# Altium schematic sheet W5500_Ethernet.SchDoc: =SheetTitle
size B; SheetTitle: W5500 Ethernet Controller; DrawnBy: Samyar Sadat Akhavi
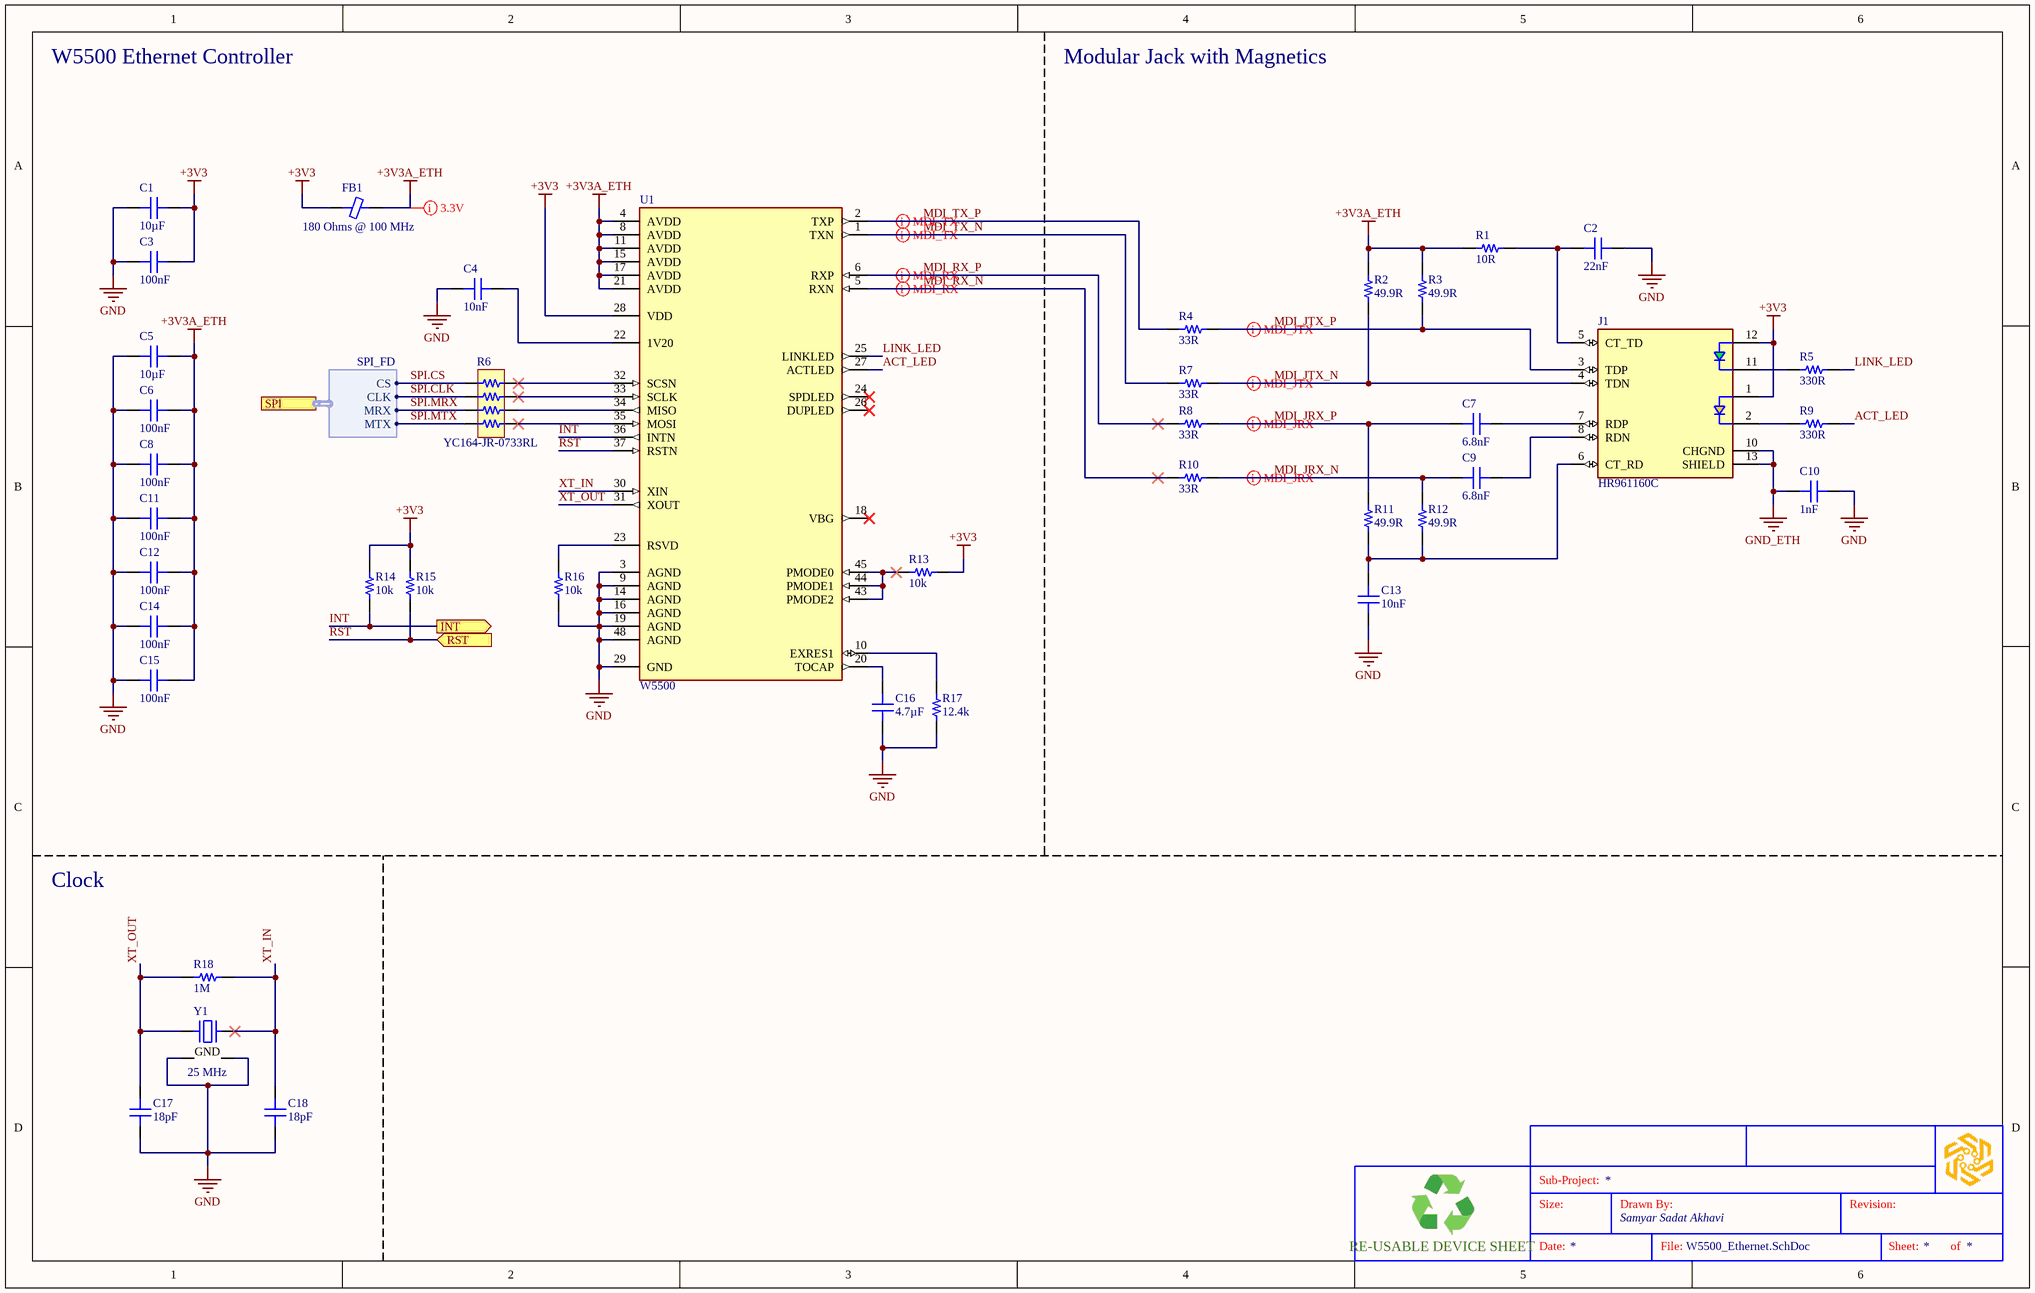
[diagram p0: W5500_Ethernet.SchDoc]

## Parts
?  (no value)  (graphical)
C1  10µF  [CAP 1206_3216]
C2  22nF  [CAP 0603_1608]
C3  100nF  [CAP 0603_1608]
C4  10nF  [CAP 0603_1608]
C5  10µF  [CAP 1206_3216]
C6  100nF  [CAP 0603_1608]
C7  6.8nF  [CAP 0603_1608]
C8  100nF  [CAP 0603_1608]
C9  6.8nF  [CAP 0603_1608]
C10  1nF  [CAP 1206_3216]
C11  100nF  [CAP 0603_1608]
C12  100nF  [CAP 0603_1608]
C13  10nF  [CAP 0603_1608]
C14  100nF  [CAP 0603_1608]
C15  100nF  [CAP 0603_1608]
C16  4.7µF  [CAP 0603_1608]
C17  18pF  [CAP 0603_1608]
C18  18pF  [CAP 0603_1608]
FB1  180 Ohms @ 100 MHz  [FER 0603_1608]
GRAPH?  SGR-STDDSM  (value not drawn)  (graphical)
J1  HR961160C  [HANRUN_HR961160C]
R1  10R  [RES 0603_1608]
R2  49.9R  [RES 0603_1608]
R3  49.9R  [RES 0603_1608]
R4  33R  [RES 0603_1608]
R5  330R  [RES 0603_1608]
R6  YC164-JR-0733RL  [RESNET 1206-8 CONVEX]
R7  33R  [RES 0603_1608]
R8  33R  [RES 0603_1608]
R9  330R  [RES 0603_1608]
R10  33R  [RES 0603_1608]
R11  49.9R  [RES 0603_1608]
R12  49.9R  [RES 0603_1608]
R13  10k  [RES 0603_1608]
R14  10k  [RES 0603_1608]
R15  10k  [RES 0603_1608]
R16  10k  [RES 0603_1608]
R17  12.4k  [RES 0603_1608]
R18  1M  [RES 0603_1608]
U1  W5500  [48LQFP_W5500_WIZ]
Y1  25 MHz  [EPSON TSX-3225]

## Ports
INT (out, see Power_Board[3B]), RST (in, see Power_Board[3B]), SPI (harness SPI_FD, see Power_Board[3B])

## Harnesses
SPI_FD: CLK, CS, MRX, MTX

## Nets
+3V3: C1.2 C3.1 FB1.1 J1.1(YLW_A) J1.12(GRN_A) R13.1 R14.2 R15.1 U1.28(VDD)
+3V3A_ETH: C5.2 C6.1 C8.1 C11.1 C12.1 C14.1 C15.1 FB1.2 R1.2 R2.2 R3.2 U1.4(AVDD) U1.8(AVDD) U1.11(AVDD) U1.15(AVDD) U1.17(AVDD) U1.21(AVDD)
GND: C1.1 C2.2 C3.2 C4.2 C5.1 C6.2 C8.2 C10.1 C11.2 C12.2 C13.2 C14.2 C15.2 C16.1 C17.1 C18.1 R16.2 R17.1 U1.3(AGND) U1.9(AGND) U1.14(AGND) U1.16(AGND) U1.19(AGND) U1.29(GND) U1.48(AGND) Y1.2(GND) Y1.4(GND)
GND_ETH: C10.2 J1.10(CHGND) J1.13(SHIELD)
ACT_LED: R9.2 U1.27(ACTLED)
INT: R14.1 U1.36(INTN) ; port INT
LINK_LED: R5.2 U1.25(LINKLED)
MDI_JRX_N: C9.1 R10.2 R12.2
MDI_JRX_P: C7.2 R8.2 R11.2
MDI_JTX_N: J1.4(TDN) R2.1 R7.2
MDI_JTX_P: J1.3(TDP) R3.1 R4.2
MDI_RX_N: R10.1 U1.5(RXN)
MDI_RX_P: R8.1 U1.6(RXP)
MDI_TX_N: R7.1 U1.1(TXN)
MDI_TX_P: R4.1 U1.2(TXP)
RST: R15.2 U1.37(RSTN) ; port RST
SPI.CLK: R6.2 ; port SPI.CLK
SPI.CS: R6.1 ; port SPI.CS
SPI.MRX: R6.3 ; port SPI.MRX
SPI.MTX: R6.4 ; port SPI.MTX
XT_IN: C18.2 R18.2 U1.30(XIN) Y1.3
XT_OUT: C17.2 R18.1 U1.31(XOUT) Y1.1
NetC2_1: C2.1 J1.5(CT_TD) R1.1
NetC4_1: C4.1 U1.22(1V20)
NetC7_1: C7.1 J1.7(RDP)
NetC9_2: C9.2 J1.8(RDN)
NetC13_1: C13.1 J1.6(CT_RD) R11.1 R12.1
NetC16_2: C16.2 U1.20(TOCAP)
NetJ1_2: J1.2(YLW_K) R9.1
NetJ1_11: J1.11(GRN_K) R5.1
NetR6_5: R6.5 U1.35(MOSI)
NetR6_6: R6.6 U1.34(MISO)
NetR6_7: R6.7 U1.33(SCLK)
NetR6_8: R6.8 U1.32(SCSN)
NetR13_2: R13.2 U1.43(PMODE2) U1.44(PMODE1) U1.45(PMODE0)
NetR16_1: R16.1 U1.23(RSVD)
NetR17_2: R17.2 U1.10(EXRES1)

Not connected (* = marked no-connect by the designer): U1 18(VBG)* 24(SPDLED)* 26(DUPLED)*

## Layout directives
differential pair: MDI_JRX_N, MDI_JRX_P, MDI_JTX_N, MDI_JTX_P, MDI_RX_N, MDI_RX_P, MDI_TX_N, MDI_TX_P
rule Supply Nets [Voltage = 3.300]: +3V3A_ETH

## Notes on the sheet
- W5500 Ethernet Controller
- Modular Jack with Magnetics
- Clock
- Sub-Project:
- Size:
- Drawn By:
- Revision:
- Date:
- File:
- Sheet:
- of
- (in symbol SGR-STDDSM) RE-USABLE DEVICE SHEET

## Library data of the parts
? = SGR-STDTBSB: STANDARD SCHEMATICS TITLE BLOCK
C1 C5 = GEN-CC10UT10V25KX7R1206: GENERIC 1206 MLC CAPACITOR; Tolerance: ±10%; Voltage: 25V; Dielectric: X7R; Part Number: GEN-CC10UT10V25KX7R1206; Value: 10µF
C2 = GEN-CC22NT20V25KX7R603: GENERIC 0603 MLC CAPACITOR; Tolerance: ±20%; Voltage: 25V; Dielectric: X7R; Part Number: GEN-CC22NT20V25KX7R603; Value: 22nF
C3 C6 C8 C11 C12 C14 C15 = GEN-CC100NT10V50KX7R603: GENERIC 0603 MLC CAPACITOR; Tolerance: ±10%; Voltage: 50V; Dielectric: X7R; Part Number: GEN-CC100NT10V50KX7R603; Value: 100nF
C4 C13 = GEN-CC10NT10V50KX7R603: GENERIC 0603 MLC CAPACITOR; Tolerance: ±10%; Voltage: 50V; Dielectric: X7R; Part Number: GEN-CC10NT10V50KX7R603; Value: 10nF
C7 C9 = GEN-CC6N8T10V50KX7R603: GENERIC 0603 MLC CAPACITOR; Tolerance: ±10%; Voltage: 50V; Dielectric: X7R; Part Number: GEN-CC6N8T10V50KX7R603; Value: 6.8nF
C10 = GEN-CC1NT10V2000KX7R1206: GENERIC 1206 MLC CAPACITOR; Tolerance: ±10%; Voltage: 2000V; Dielectric: X7R; Part Number: GEN-CC1NT10V2000KX7R1206; Value: 1nF
C16 = GEN-CC4U7T106V3KX7R603: GENERIC 0603 MLC CAPACITOR; Tolerance: ±10%; Voltage: 6.3V; Dielectric: X7R; Part Number: GEN-CC4U7T106V3KX7R603; Value: 4.7µF
C17 C18 = GEN-CC18PT5V50KC0G603: GENERIC 0603 MLC CAPACITOR; Tolerance: ±5%; Voltage: 50V; Dielectric: C0G; Part Number: GEN-CC18PT5V50KC0G603; Value: 18pF
FB1 = MPZ1608S181ATAH0: FERRITE BEAD 180 OHM 0603 1LN; Manufacturer: TDK Corporation; Current Rating (Max): 2A; DC Resistance (DCR) (Max): 50mOhm; Filter Type: Power Line; Number of Lines: 1; Part Number: MPZ1608S181ATAH0; ComponentLink1Description: Datasheet; ComponentLink1URL: https://product.tdk.com/info/en/catalog/datasheets/beads_commercial_power_mpz1608_en.pdf?ref_disty=digikey; ComponentLink2Description: DigiKey Link; ComponentLink2URL: https://www.digikey.com/en/products/detail/tdk-corporation/MPZ1608S181ATAH0/2117944; Device Package: 0603 (1608 Metric); Height (Max): 0.030" (0.75mm); Impedance @ Frequency: 180 Ohms @ 100 MHz; LastUpdated: 4/5/2026 8:28:05 PM; Lifecycle Status: Active; Minimum Order: 1; Mounting Type: Surface Mount; Operating Temperature: -55°C ~ 125°C; Package / Case: 0603 (1608 Metric); Packaging: TapeAndReel; PartId: 1025; Part Status: Active; Price: 0.02; Series: MPZ; Size / Dimension: 0.063" L x 0.031" W (1.60mm x 0.80mm); Supplier 1: DigiKey; Supplier Part Number 1: 445-MPZ1608S181ATAH0CT-ND; Value: 180 Ohms @ 100 MHz
GRAPH? = SGR-STDDSM: STANDARD DEVICE SHEET MARKING; Part Number: SGR-STDDSM
J1 = HR961160C: MAGJACK SMT R/A 8P8C RJ45 ETHERNET; Manufacturer: HanRun; Part Number: HR961160C; Supplier 1: Ozdisan; Supplier Part Number 1: HR961160C
R1 = GEN-CRR10T1P8603: GENERIC 0603 CHIP RESISTOR; Tolerance: ±1%; Power: 0.125W; Part Number: GEN-CRR10T1P8603; Value: 10R
R2 R3 R11 R12 = GEN-CRR49R9T1P8603: GENERIC 0603 CHIP RESISTOR; Tolerance: ±1%; Power: 0.125W; Part Number: GEN-CRR49R9T1P8603; Value: 49.9R
R4 R7 R8 R10 = GEN-CRR33T1P8603: GENERIC 0603 CHIP RESISTOR; Tolerance: ±1%; Power: 0.125W; Part Number: GEN-CRR33T1P8603; Value: 33R
R5 R9 = GEN-CRR330T5P8603: GENERIC 0603 CHIP RESISTOR; Tolerance: ±5%; Power: 0.125W; Part Number: GEN-CRR330T5P8603; Value: 330R
R6 = YC164-JR-0733RL: RES ARRAY 4 RES 33 OHM 1206; Manufacturer: Yageo; Circuit Type: Isolated; Number of Resistors: 4; Power Per Element: 62.5mW; Resistance (Ohms): 33; Temperature Coefficient: ±200ppm/°C; Tolerance: ±5%; Part Number: YC164-JR-0733RL; Applications: DDRAM, SDRAM; ComponentLink1Description: Datasheet; ComponentLink1URL: https://www.yageo.com/upload/media/product/productsearch/datasheet/rchip/PYu-YC_TC_group_51_RoHS_L_9.pdf; ComponentLink2Description: DigiKey Link; ComponentLink2URL: http://digikey.com/product-detail/en/yageo/YC164-JR-0733RL/YC164J-33CT-ND/1005642; Height - Seated (Max): 0.028" (0.70mm); LastUpdated: 9/2/2020 1:23:24 AM; Lifecycle Status: Active; Minimum Order: 1; Mounting Type: Surface Mount; Number of Pins: 8; Operating Temperature: -55°C ~ 155°C; Package / Case: 1206 (3216 Metric), Convex, Long Side Terminals; Packaging: TapeAndReel; PartId: 145; Part Status: Active; Price: 0.01; Series: YC164; Size / Dimension: 0.126" L x 0.063" W (3.20mm x 1.60mm); Supplier 1: DigiKey; Supplier Part Number 1: YC164J-33CT-ND
R13-R16 = GEN-CRR10KT1P8603: GENERIC 0603 CHIP RESISTOR; Tolerance: ±1%; Power: 0.125W; Part Number: GEN-CRR10KT1P8603; Value: 10k
R17 = GEN-CRR12K4T1P8603: GENERIC 0603 CHIP RESISTOR; Tolerance: ±1%; Power: 0.125W; Part Number: GEN-CRR12K4T1P8603; Value: 12.4k
R18 = GEN-CRR1MT5P8603: GENERIC 0603 CHIP RESISTOR; Tolerance: ±5%; Power: 0.125W; Part Number: GEN-CRR1MT5P8603; Value: 1M
U1 = W5500: IC CTLR 3-1 ETH TCP/IP 48LQFP; Manufacturer: WIZnet; Copyright: Copyright (C) 2025 Ultra Librarian. All rights reserved.; Part Number: W5500; Supplier 1: DigiKey; Supplier Part Number 1: 1278-W5500CT-ND
Y1 = TSX-3225 25.0000MF20P-C0: CRYSTAL 25.0000MHZ 18PF SMD; Manufacturer: EPSON; ESR (Equivalent Series Resistance): 40 Ohms; Frequency Stability: ±20ppm; Frequency Tolerance: ±10ppm; Operating Mode: Fundamental; Part Number: TSX-3225 25.0000MF20P-C0; ComponentLink1Description: Datasheet; ComponentLink1URL: https://support.epson.biz/td/api/doc_check.php?dl=brief_TSX-3225&lang=en; ComponentLink2Description: DigiKey Link; ComponentLink2URL: https://www.digikey.com/en/products/detail/epson/TSX-3225-25-0000MF20P-C0/7430947; Frequency: 25 MHz; Height - Seated (Max): 0.024" (0.60mm); LastUpdated: 4/5/2026 8:41:19 PM; Lifecycle Status: Active; Load Capacitance: 18pF; Minimum Order: 1; Mounting Type: Surface Mount; Operating Temperature: -20°C ~ 85°C; Package / Case: 4-SMD, No Lead; Packaging: TapeAndReel; PartId: 447; Part Status: Active; Price: 0.21; Series: TSX-3225; Size / Dimension: 0.126" L x 0.098" W (3.20mm x 2.50mm); Supplier 1: DigiKey; Supplier Part Number 1: SER4212CT-ND; Type: MHz Crystal; Value: 25 MHz